# EAGLE design mikro2 (EAGLE 7.4.0)
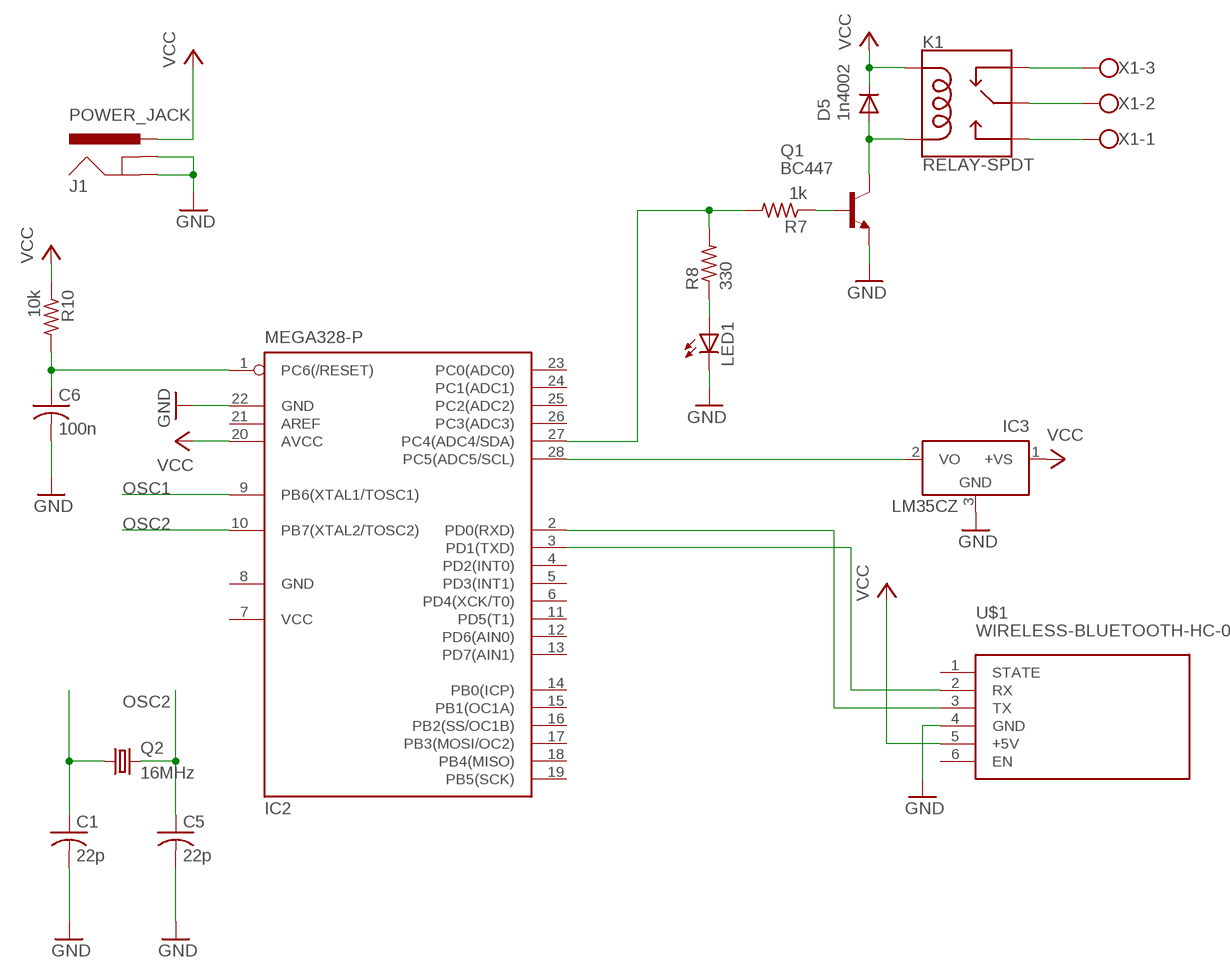
[diagram p0: schematic, sheet 1]

## Parts
C1  22p  C-US050-024X044  [C050-024X044]
C5  22p  C-US050-024X044  [C050-024X044]
C6  100n  C-US050-024X044  [C050-024X044]
D5  1n4002  1N4446  [DO35-10]
IC2  MEGA328-P  MEGA8-P  [DIL28-3]
IC3  LM35CZ  [TO92]
J1  POWER_JACK  [POWER_JACK_PTH]
K1  RELAY-SPDT  [RELAY_G5LE]
LED1  LED5MM  [LED5MM]
Q1  BC447  [TO92-EBC]
Q2  16MHz  CRYSTALHC49S  [HC49/S]
R7  1k  R-US_0207/7  [0207/7]
R8  330  R-US_0207/7  [0207/7]
R10  10k  R-US_0207/7  [0207/7]
U$1  WIRELESS-BLUETOOTH-HC-05  [WIRELESS-BLUETOOTH-HC-05]
X1  W237-103  [W237-103]

## Nets
GND: C1.2 C5.2 C6.2 IC2.22(GND) IC3.3(GND) J1.GND J1.GNDBREAK LED1.K(C) Q1.E U$1.4(GND)
N$1: IC2.28(PC5(ADC5/SCL)) IC3.2(VO)
N$2: K1.3(NO) X1.1
N$3: K1.1(MAIN) X1.2
N$4: K1.4(NC) X1.3
N$5: IC2.2(PD0(RXD)) U$1.3(TX)
N$6: IC2.3(PD1(TXD)) U$1.2(RX)
N$9: IC2.27(PC4(ADC4/SDA)) R7.2 R8.2
N$11: Q1.B R7.1
N$14: C6.1 IC2.1(PC6(/RESET)) R10.2
N$15: LED1.A R8.1
N$17: D5.A K1.5(COIL2) Q1.C
OSC1: C1.1 IC2.9(PB6(XTAL1/TOSC1)) Q2.1
OSC2: C5.1 IC2.10(PB7(XTAL2/TOSC2)) Q2.2
VCC: D5.C IC2.20(AVCC) IC3.1(+VS) J1.PWR K1.2(COIL1) R10.1 U$1.5(+5V)
Unconnected: IC2.4(PD2(INT0)) IC2.5(PD3(INT1)) IC2.6(PD4(XCK/T0)) IC2.11(PD5(T1)) IC2.12(PD6(AIN0)) IC2.13(PD7(AIN1)) IC2.14(PB0(ICP)) IC2.15(PB1(OC1A)) IC2.16(PB2(SS/OC1B)) IC2.17(PB3(MOSI/OC2)) IC2.18(PB4(MISO)) IC2.19(PB5(SCK)) IC2.21(AREF) IC2.23(PC0(ADC0)) IC2.24(PC1(ADC1)) IC2.25(PC2(ADC2)) IC2.26(PC3(ADC3)) U$1.1(STATE) U$1.6(EN)

## Power pins joined to a net without a drawn wire
GND: IC2.8(GND)
VCC: IC2.7(VCC)

## Library data of the parts
C1 C5 C6 = adafruit:C-US: CAPACITOR, American symbol
D5 = diode:1N4446: DIODE high speed (Philips)
IC2 = atmel:MEGA8-P: MICROCONTROLLER 8 Kbytes FLASH, 1 kbytes SRAM, 512 bytes EEPROM, USART, 4-channel 10 bit ADC, 2-channel 8 bit ADC Pin compatible with Atmega48, ATMega88, ATMega168 Source: avr.lbr; OC_FARNELL: unknown; OC_NEWARK: unknown
IC3 = lm35:LM35: Single-Supply Centigrade Temperature Sensor Vout = (10mV/°C x Temp °C) +5mmmV Source: http://www.national.com/ds/LM/LM35.pdf
J1 = SparkFun-Connectors:POWER_JACK: Power Jack Connector This is the standard 5.5mm barrel jack for power. The PTH is the most common, proven, reliable, footprint. The Slot footprint only works if the mill layer is transmitted to the PCB fab house so be warned. Here are the connectors we sell at SparkFun: DC Barrel Power Jack/Connector <https://www.sparkfun.com/products/119> (PRT-00119) DC Barrel Power Jack/Connector (SMD) <https://www.sparkfun.com/products/12748> (PRT-12748) DC Barrel Jack Adapter - Breadboard Compatible <https://www.sparkfun.com/products/10811> (PRT-10811) It is used on this SparkFun product (and many, many others): SparkFun RedBoard - Programmed with Arduino <https://www.sparkfun.com/products/12757> (DEV-12757) Also, if you need a mating power supply or connector, please check these out: Wall Adapter Power Supply - 9VDC 650mA <https://www.sparkfun.com/products/298> (TOL-00298) DC Barrel Jack Adapter - Male <https://www.sparkfun.com/products/10287> (PRT-10287); PROD_ID: CONN-08197
K1 = SparkFun-Electromechanical:RELAY-SPDT: SPDT Electromechanical Relay Single-pole, double-throw sealed relays. When current is applied to the coil, it throws a simple changeover switch, terminating the connection from the NC contact to ground and closing the NO contact. Use them to switch high voltage/high current devices. SparkFun Products JQX-15F: Relay SPDT Sealed - 20A <https://www.sparkfun.com/products/10924> (COM-10924) JZC-11F: Relay SPDT Sealed <https://www.sparkfun.com/products/100> (COM-00100); PROD_ID: COMP-14214
LED1 = led:LED: LED OSRAM: - CHIPLED LG R971, LG N971, LY N971, LG Q971, LY Q971, LO R971, LY R971 LH N974, LH R974 LS Q976, LO Q976, LY Q976 LO Q996 - Hyper CHIPLED LW Q18S LB Q993, LB Q99A, LB R99A - SideLED LS A670, LO A670, LY A670, LG A670, LP A670 LB A673, LV A673, LT A673, LW A673 LH A674 LY A675 LS A676, LA A676, LO A676, LY A676, LW A676 LS A679, LY A679, LG A679 - Hyper Micro SIDELED® LS Y876, LA Y876, LO Y876, LY Y876 LT Y87S - SmartLED LW L88C, LW L88S LB L89C, LB L89S, LG L890 LS L89K, LO L89K, LY L89K LS L896, LA L896, LO L896, LY L896 - TOPLED LS T670, LO T670, LY T670, LG T670, LP T670 LSG T670, LSP T670, LSY T670, LOP T670, LYG T670 LG T671, LOG T671, LSG T671 LB T673, LV T673, LT T673, LW T673 LH T674 LS T676, LA T676, LO T676, LY T676, LB T676, LH T676, LSB T676, LW T676 LB T67C, LV T67C, LT T67C, LS T67K, LO T67K, LY T67K, LW E67C LS E67B, LA E67B, LO E67B, LY E67B, LB E67C, LV E67C, LT E67C LW T67C LS T679, LY T679, LG T679 LS T770, LO T770, LY T770, LG T770, LP T770 LB T773, LV T773, LT T773, LW T773 LH T774 LS E675, LA E675, LY E675, LS T675 LS T776, LA T776, LO T776, LY T776, LB T776 LHGB T686 LT T68C, LB T68C - Hyper Mini TOPLED® LB M676 - Mini TOPLED Santana® LG M470 LS M47K, LO M47K, LY M47K Source: http://www.osram.convergy.de LUXEON: - LUMILED® LXK2-PW12-R00, LXK2-PW12-S00, LXK2-PW14-U00, LXK2-PW14-V00 LXK2-PM12-R00, LXK2-PM12-S00, LXK2-PM14-U00 LXK2-PE12-Q00, LXK2-PE12-R00, LXK2-PE12-S00, LXK2-PE14-T00, LXK2-PE14-U00 LXK2-PB12-K00, LXK2-PB12-L00, LXK2-PB12-M00, LXK2-PB14-N00, LXK2-PB14-P00, LXK2-PB14-Q00 LXK2-PR12-L00, LXK2-PR12-M00, LXK2-PR14-Q00, LXK2-PR14-R00 LXK2-PD12-Q00, LXK2-PD12-R00, LXK2-PD12-S00 LXK2-PH12-R00, LXK2-PH12-S00 LXK2-PL12-P00, LXK2-PL12-Q00, LXK2-PL12-R00 Source: www.luxeon.com KINGBRIGHT: KA-3528ASYC Source: www.kingbright.com
Q1 = transistor-npn:BC447*: NPN Transistor
Q2 = adafruit:CRYSTAL: CRYSTAL; OC_FARNELL: 1667008; OC_NEWARK: unknown
R7 R8 R10 = adafruit:R-US_: RESISTOR, American symbol
U$1 = diy-modules:WIRELESS-BLUETOOTH-HC-05: Bluetooth Transceiver Module based on HC-05 board Tutorial is available here: https://arduino-info.wikispaces.com/BlueTooth-HC05-HC06-Modules-How-To Click here to find device on ebay.com <http://www.ebay.com/sch/hc-05+module+rs232>
X1 = con-wago-500:W237-103: WAGO SCREW CLAMP; MPN: 237-103; OC_FARNELL: unknown; OC_NEWARK: 18M7116

## Net classes
0 default: width 0.152 mm, drill 0.241 mm, clearance 0.152 mm

## Board
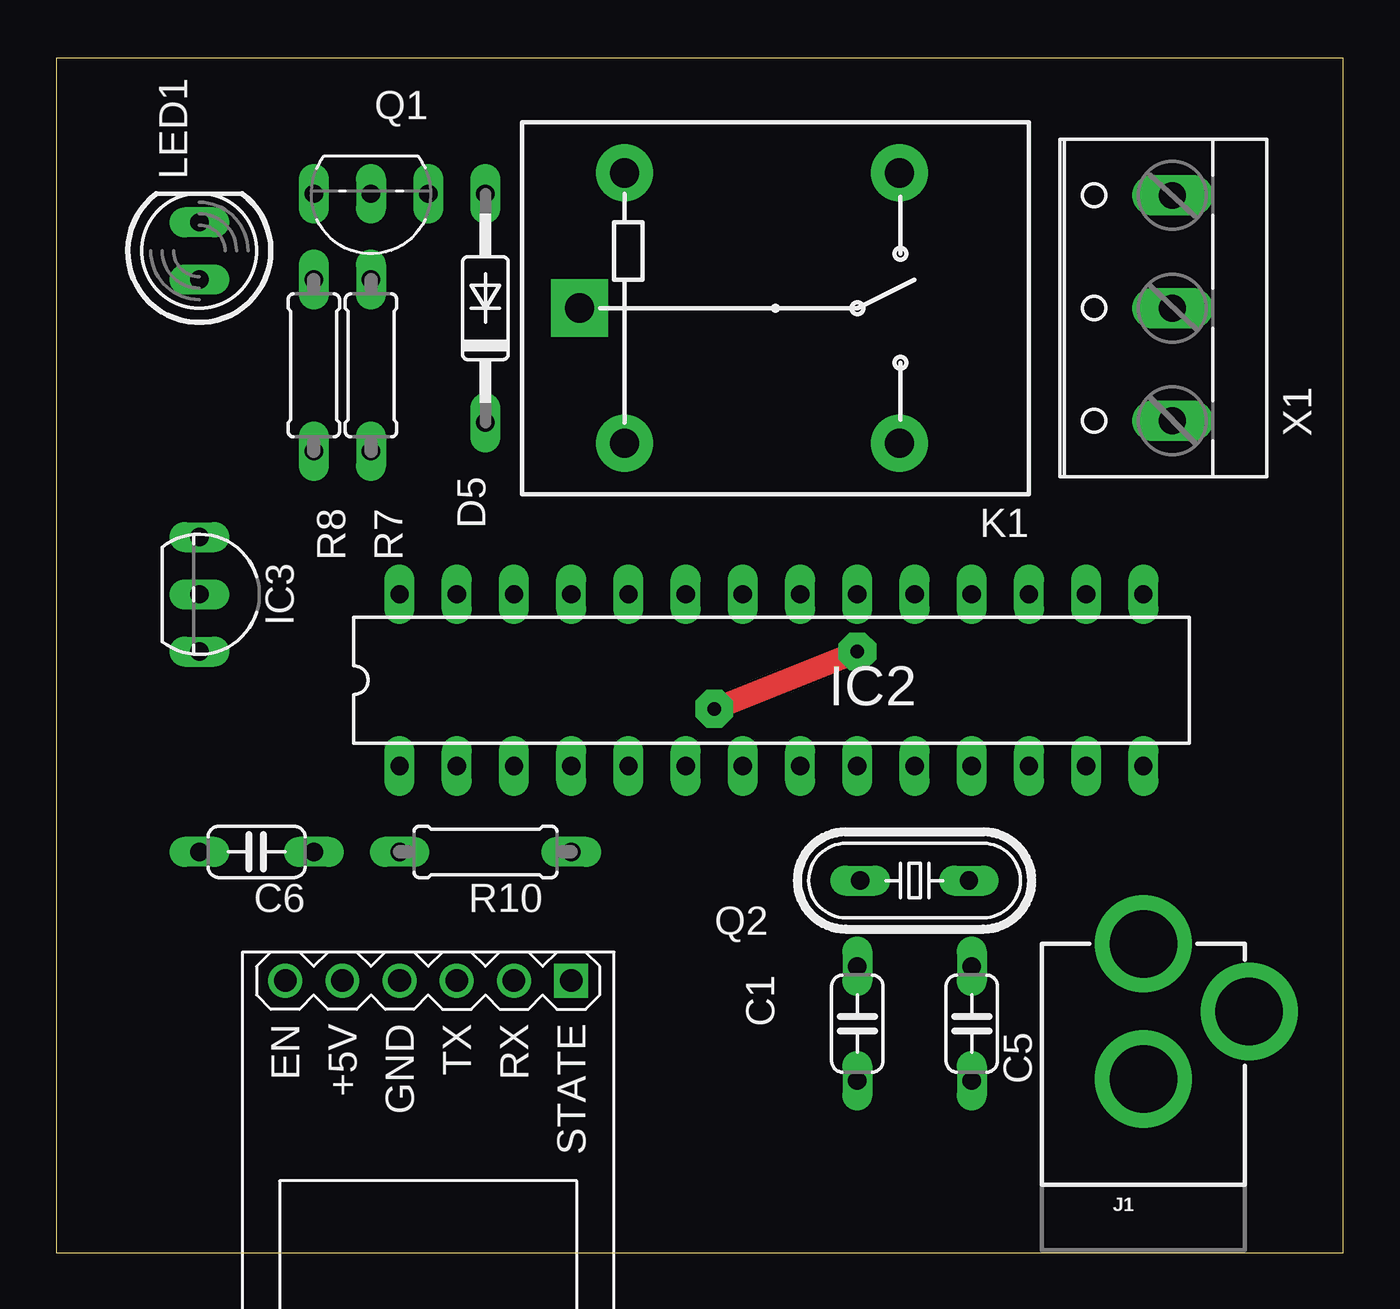
[diagram p1: board, top side]
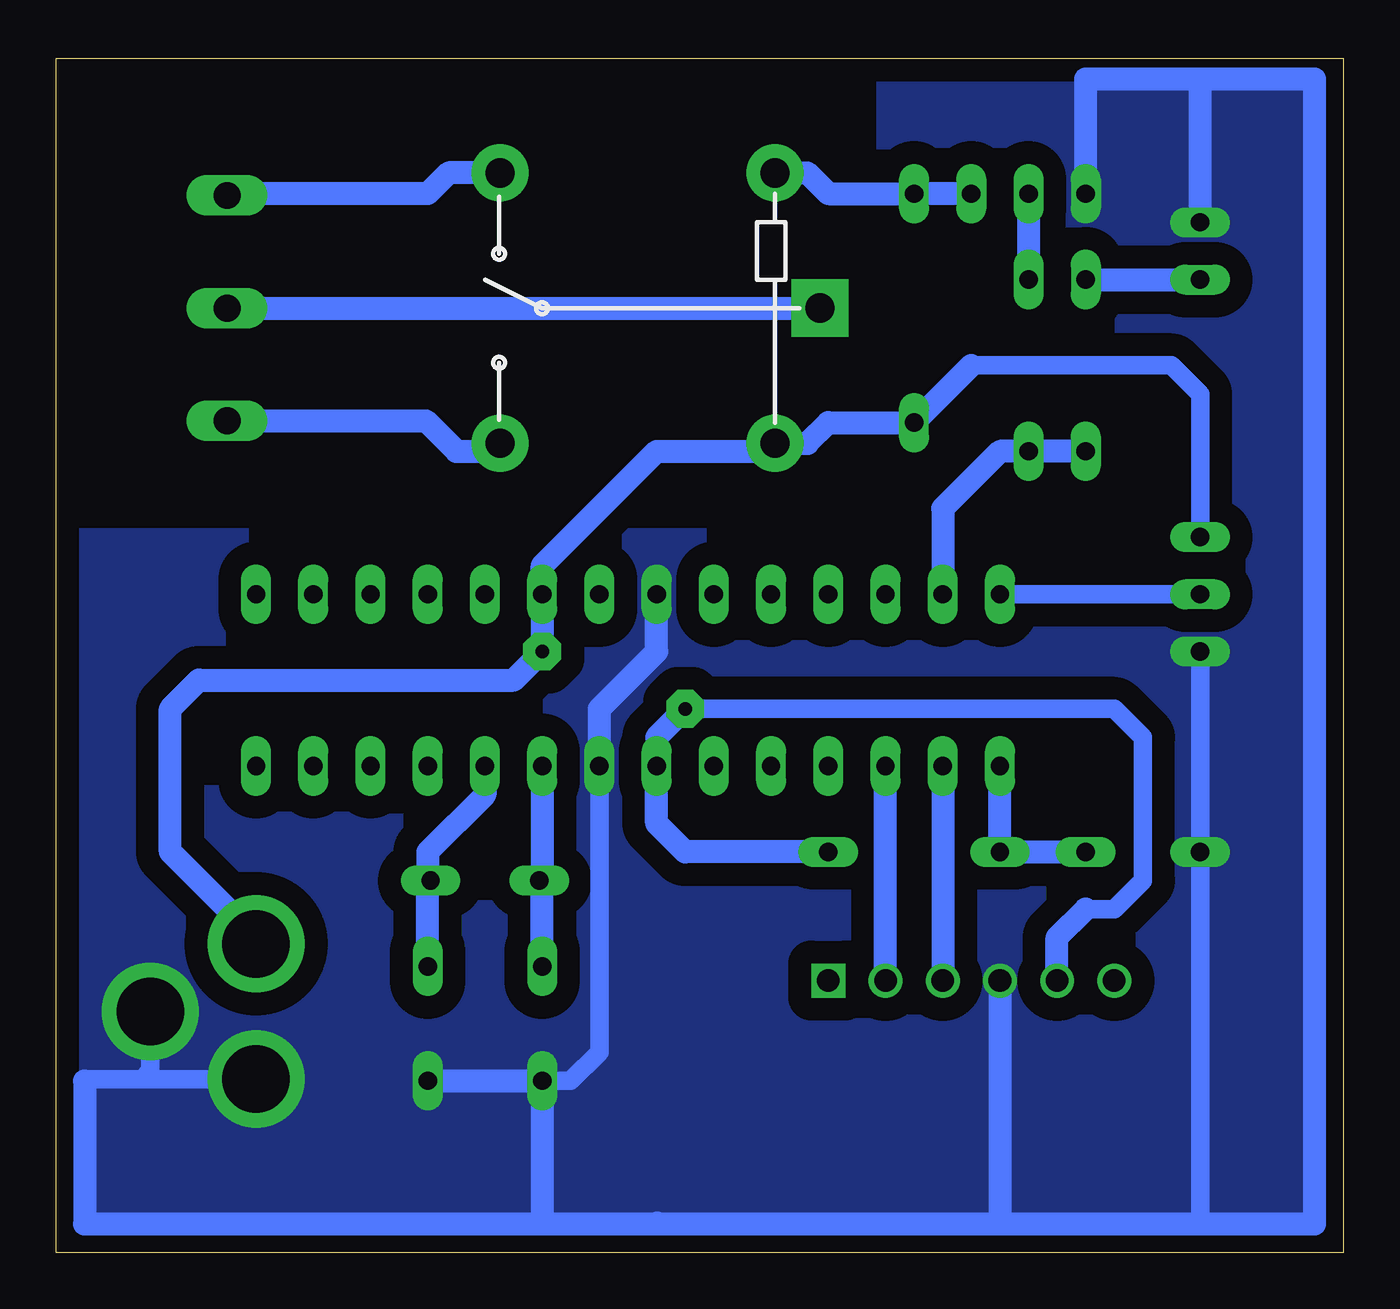
[diagram p2: board, bottom side, seen from below]

Size 57.13 x 53.01 mm. Coordinates in mm from the lower left corner, seen from the top.
Outline: 0,0 57.13,0 57.13,53.01 0,53.01 0,0
Copper layers (1*16): Top 0.035mm / dielectric 1.5mm / Bottom 0.035mm
Design rules "default": minimum track width 10mil, minimum drill 24mil, track to track 8mil, track to pad 8mil, pad to pad 8mil, via to via 8mil, smd to smd 8mil, copper to edge 40mil, drill to drill 8mil, minimum pad ring 10mil, minimum via ring 8mil, stop-mask expansion 4mil, vias tented up to drill 0mil, thermal gap 10mil

### Footprints (pad centres in the part's own frame; a part is rotated, then mirrored left to right if it is on the bottom)
C050-024X044 = drill 0.813 long: 1 -2.54,0; 2 2.54,0
DO35-10 = drill 0.813 long: A 5.08,0; C -5.08,0
DIL28-3 = drill 0.813 long: 1 -16.51,-3.81; 2 -13.97,-3.81; 3 -11.43,-3.81; 4 -8.89,-3.81; 5 -6.35,-3.81; 6 -3.81,-3.81; 7 -1.27,-3.81; 8 1.27,-3.81; 9 3.81,-3.81; 10 6.35,-3.81; 11 8.89,-3.81; 12 11.43,-3.81; 13 13.97,-3.81; 14 16.51,-3.81; 15 16.51,3.81; 16 13.97,3.81; 17 11.43,3.81; 18 8.89,3.81; 19 6.35,3.81; 20 3.81,3.81; 21 1.27,3.81; 22 -1.27,3.81; 23 -3.81,3.81; 24 -6.35,3.81; 25 -8.89,3.81; 26 -11.43,3.81; 27 -13.97,3.81; 28 -16.51,3.81
TO92 = drill 0.813 long: 1 -2.54,0; 2 0,0; 3 2.54,0
POWER_JACK_PTH = drill 2.997 pad 4.318: GND 0,7.7; GNDBREAK 4.7,10.7; PWR 0,13.7
RELAY_G5LE = drill 1.3 pad 2.54 square: 1 8.52,-0.005 | drill 1.3 pad 2.54: 2 6.52,5.995; 3 -5.68,5.995; 4 -5.68,-6.005; 5 6.52,-6.005
LED5MM = drill 0.813 long: A -1.27,0; K 1.27,0
TO92-EBC = drill 0.813 long: B 0,-1.27; C -2.54,-1.27; E 2.54,-1.27
HC49/S = drill 0.813 long: 1 -2.413,0; 2 2.413,0
0207/7 = drill 0.813 long: 1 -3.81,0; 2 3.81,0
WIRELESS-BLUETOOTH-HC-05 = drill 1 square: 1 -6.35,-17.145 | drill 1: 2 -3.81,-17.145; 3 -1.27,-17.145; 4 1.27,-17.145; 5 3.81,-17.145; 6 6.35,-17.145
W237-103 = drill 1.194 long: 1 -5,-1.29; 2 0,-1.29; 3 5,-1.29

### Placement (x,y rotation side)
C1  35.56,10.16 270 top
C5  40.64,10.16 270 top
C6  8.89,17.78 180 top
D5  19.05,41.91 90 top
IC2  31.75,25.4 0 top
IC3  6.35,29.21 270 top
J1  48.26,0 0 top
K1  31.75,41.91 180 top
LED1  6.35,44.45 90 top
Q1  13.97,45.72 180 top
Q2  38.1,16.51 0 top
R7  13.97,39.37 270 top
R8  11.43,39.37 270 top
R10  19.05,17.78 180 top
U$1  16.51,-5.08 180 top
X1  48.26,41.91 90 top

### Tracks (layer width: path | path; a pad name or v marks a point on that pad's centre or on a via)
GND
  Bottom 0.813: C1.2 34.29,7.62 33.02,8.89 IC2.8 | IC3.3 C6.2 6.35,1.27 | J1.GND 53.34,7.7 | 53.34,7.7 55.8,7.7 55.88,7.62 | J1.GNDBREAK 52.96,8.08 53.34,7.7
  Bottom 1.016: 6.35,52.07 1.27,52.07 1.27,1.27 6.35,1.27 15.24,1.27 | 6.35,52.07 11.43,52.07 Q1.E | 35.56,1.27 27.94,1.27 | 27.94,1.27 15.24,1.27 | IC2.8 33.02,24.13 30.48,26.67 IC2.22 | C5.2 C1.2 35.56,1.27 | 55.88,7.62 55.88,1.27 35.56,1.27 | 30.44,1.31 27.94,1.27 | LED1.K 6.35,52.07 | U$1.4 15.24,1.27
  pour Bottom (isolate 1.016, no thermals): 0,0 57.15,0 57.15,31.75 20.32,31.75 20.32,53.34 0,53.34
N$1
  Bottom 0.813: IC2.28 IC3.2
N$2
  Bottom 1.016: X1.1 40.72,36.91 39.37,35.56 37.78,35.56 K1.3
N$3
  Bottom 1.016: X1.2 K1.1
N$4
  Bottom 1.016: K1.4 39.71,47.91 40.64,46.99 49.47,46.99 X1.3
N$5
  Bottom 1.016: IC2.2 U$1.3
N$6
  Bottom 1.016: U$1.2 IC2.3
N$9
  Bottom 1.016: R8.2 R7.2 15.24,35.56 17.78,33.02 IC2.27
N$11
  Bottom 1.016: Q1.B R7.1
N$14
  Bottom 1.016: IC2.1 R10.2 C6.1
N$15
  Bottom 1.016: R8.1 LED1.A
N$17
  Bottom 1.016: Q1.C D5.A 22.86,46.99 23.79,47.91 K1.5
OSC1
  Bottom 1.016: IC2.9 35.56,16.64 Q2.1 35.56,16.38 C1.1
OSC2
  Bottom 1.016: IC2.10 38.1,20.32 40.64,17.78 40.64,16.64 Q2.2 40.64,16.38 C5.1
VCC  (via drill 0.6 pad 1.68)
  Top 1.016: v29.21,24.13 v35.56,26.67
  Bottom 0.813: 11.43,15.24 10.16,15.24 8.89,16.51 8.89,22.86 10.16,24.13 v29.21,24.13 | 30.48,22.86 IC2.7 | IC3.1 6.35,38.1 7.62,39.37 16.51,39.37
  Bottom 1.016: 16.51,39.37 D5.C 22.86,36.83 23.78,35.91 K1.2 25.59,35.56 30.48,35.56 35.56,30.48 IC2.20 v35.56,26.67 36.83,25.4 50.8,25.4 52.07,24.13 52.07,17.78 48.26,13.97 J1.PWR | R10.1 29.21,17.78 30.48,19.05 IC2.7 | U$1.5 12.7,13.97 11.43,15.24 | 30.48,22.86 v29.21,24.13